# Altium schematic sheet P08 Hi3519 GND.SchDoc
size 420 x 297 mm
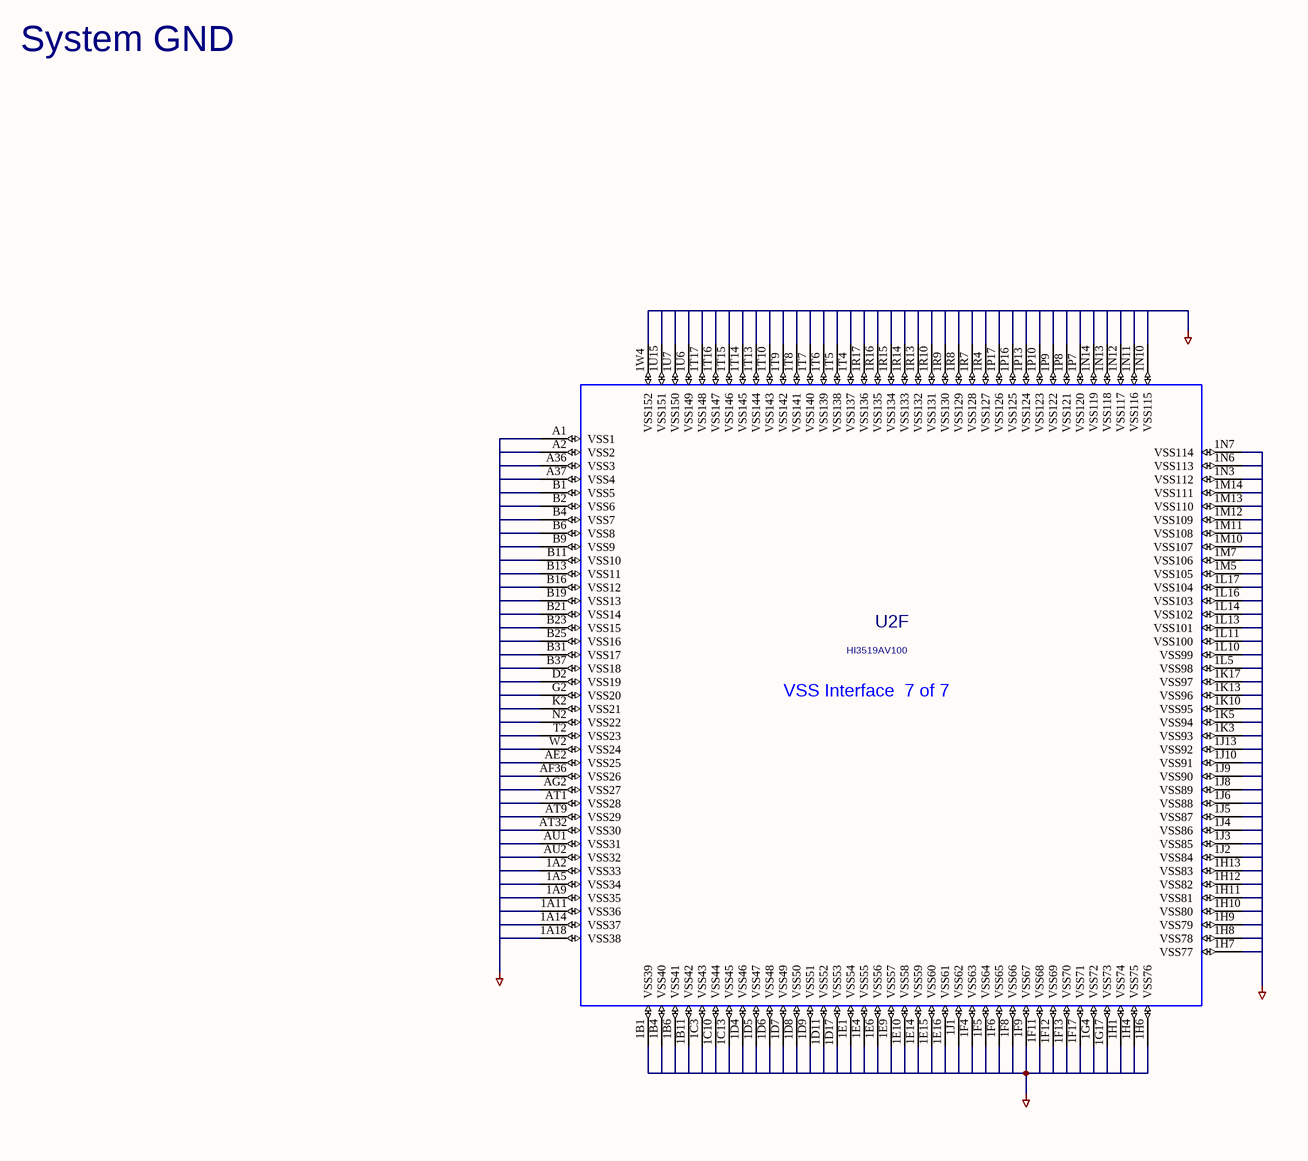
[diagram p0: P08 Hi3519 GND.SchDoc]

## Parts
U2  DEVICE: HI3519AV100  [HBGA567-16-3737]  (hidden comment: HI3519A_VO)  (part F of 7)

## Nets
GND: U2.1A2(VSS33) U2.1A5(VSS34) U2.1A9(VSS35) U2.1A11(VSS36) U2.1A14(VSS37) U2.1A18(VSS38) U2.1B1(VSS39) U2.1B4(VSS40) U2.1B6(VSS41) U2.1B11(VSS42) U2.1C3(VSS43) U2.1C10(VSS44) U2.1C13(VSS45) U2.1D4(VSS46) U2.1D5(VSS47) U2.1D6(VSS48) U2.1D7(VSS49) U2.1D8(VSS50) U2.1D9(VSS51) U2.1D11(VSS52) U2.1D17(VSS53) U2.1E1(VSS54) U2.1E4(VSS55) U2.1E6(VSS56) U2.1E9(VSS57) U2.1E10(VSS58) U2.1E14(VSS59) U2.1E15(VSS60) U2.1E16(VSS61) U2.1F4(VSS63) U2.1F5(VSS64) U2.1F6(VSS65) U2.1F8(VSS66) U2.1F9(VSS67) U2.1F11(VSS68) U2.1F12(VSS69) U2.1F13(VSS70) U2.1F17(VSS71) U2.1G4(VSS72) U2.1G17(VSS73) U2.1H1(VSS74) U2.1H4(VSS75) U2.1H6(VSS76) U2.1H7(VSS77) U2.1H8(VSS78) U2.1H9(VSS79) U2.1H10(VSS80) U2.1H11(VSS81) U2.1H12(VSS82) U2.1H13(VSS83) U2.1J1(VSS62) U2.1J2(VSS84) U2.1J3(VSS85) U2.1J4(VSS86) U2.1J5(VSS87) U2.1J6(VSS88) U2.1J8(VSS89) U2.1J9(VSS90) U2.1J10(VSS91) U2.1J13(VSS92) U2.1K3(VSS93) U2.1K5(VSS94) U2.1K10(VSS95) U2.1K13(VSS96) U2.1K17(VSS97) U2.1L5(VSS98) U2.1L10(VSS99) U2.1L11(VSS100) U2.1L13(VSS101) U2.1L14(VSS102) U2.1L16(VSS103) U2.1L17(VSS104) U2.1M5(VSS105) U2.1M7(VSS106) U2.1M10(VSS107) U2.1M11(VSS108) U2.1M12(VSS109) U2.1M13(VSS110) U2.1M14(VSS111) U2.1N3(VSS112) U2.1N6(VSS113) U2.1N7(VSS114) U2.1N10(VSS115) U2.1N11(VSS116) U2.1N12(VSS117) U2.1N13(VSS118) U2.1N14(VSS119) U2.1P7(VSS120) U2.1P8(VSS121) U2.1P9(VSS122) U2.1P10(VSS123) U2.1P13(VSS124) U2.1P16(VSS125) U2.1P17(VSS126) U2.1R4(VSS127) U2.1R7(VSS128) U2.1R8(VSS129) U2.1R9(VSS130) U2.1R10(VSS131) U2.1R13(VSS132) U2.1R14(VSS133) U2.1R15(VSS134) U2.1R16(VSS135) U2.1R17(VSS136) U2.1T4(VSS137) U2.1T5(VSS138) U2.1T6(VSS139) U2.1T7(VSS140) U2.1T8(VSS141) U2.1T9(VSS142) U2.1T10(VSS143) U2.1T13(VSS144) U2.1T14(VSS145) U2.1T15(VSS146) U2.1T16(VSS147) U2.1T17(VSS148) U2.1U6(VSS149) U2.1U7(VSS150) U2.1U15(VSS151) U2.1W4(VSS152) U2.A1(VSS1) U2.A2(VSS2) U2.A36(VSS3) U2.A37(VSS4) U2.AE2(VSS25) U2.AF36(VSS26) U2.AG2(VSS27) U2.AT1(VSS28) U2.AT9(VSS29) U2.AT32(VSS30) U2.AU1(VSS31) U2.AU2(VSS32) U2.B1(VSS5) U2.B2(VSS6) U2.B4(VSS7) U2.B6(VSS8) U2.B9(VSS9) U2.B11(VSS10) U2.B13(VSS11) U2.B16(VSS12) U2.B19(VSS13) U2.B21(VSS14) U2.B23(VSS15) U2.B25(VSS16) U2.B31(VSS17) U2.B37(VSS18) U2.D2(VSS19) U2.G2(VSS20) U2.K2(VSS21) U2.N2(VSS22) U2.T2(VSS23) U2.W2(VSS24)

## Notes on the sheet
- System GND
- (in symbol HI3519A_VO_5, part F) VSS Interface  7 of 7

## Library data of the parts
U2 = HI3519A_VO_5: PARTS: 1; OriginalSymbolOrigin: (0,0); LEVEL: STD; HETERO: (HI3519A_DDR),(HI3519A_MIPI),(HI3519A_PER),(HI3519A_SYS),(HI3519A_VO),(HI3519A_PWR),(HI3519A_VSS); CaptureCellPackProp: HI3519A_VOF; PKG_TYPE: HBGA567-16-3737